# Altium schematic sheet RelayTester.SchDoc: Relay Tester
size A4 portrait; Date: 2018.12.12; DrawnBy: Ivan Perehiniak; Address2: Ivan Perehiniak; Address3: iv.perehinik@gmail.com; Revision: 3; SheetNumber: 1; SheetTotal: 6; ProjectName: Relay Tester
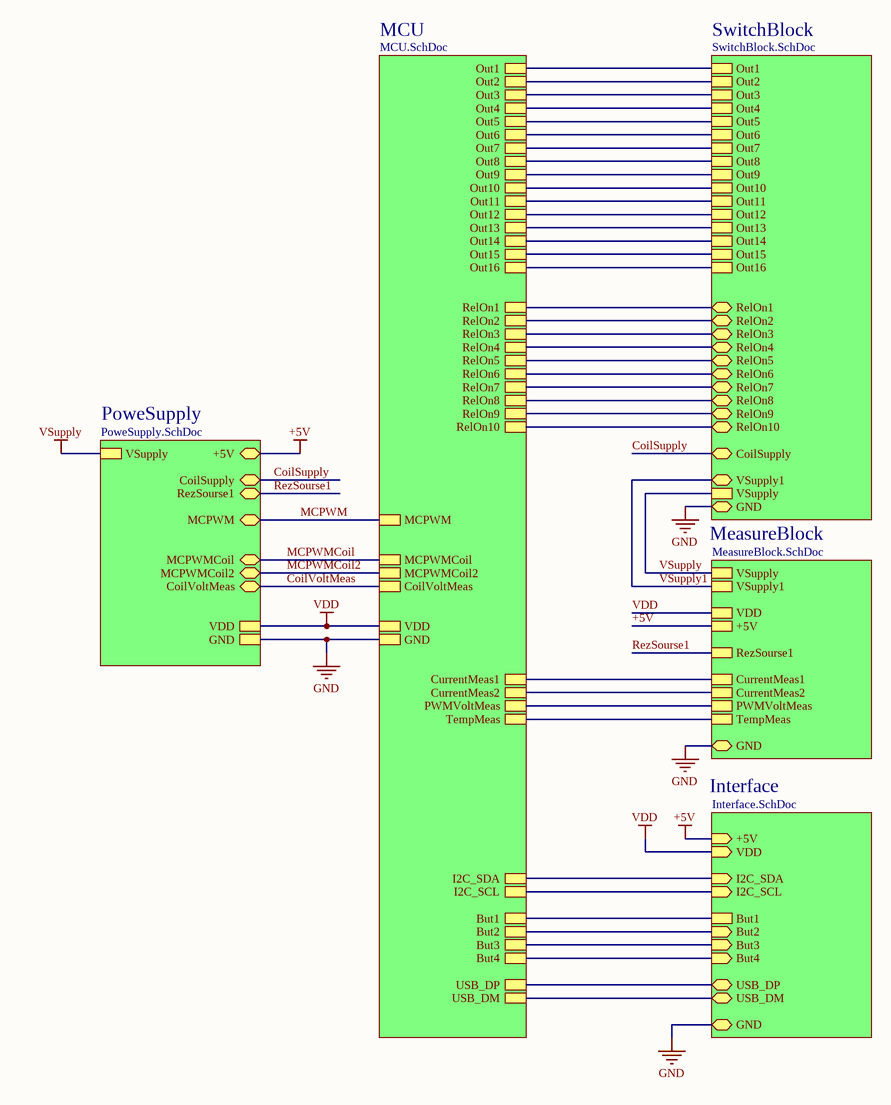
[diagram p0: RelayTester.SchDoc]

## Sub-sheets
Interface = Interface.SchDoc: +5V, I2C_SDA, I2C_SCL, GND, But1, But2, But3, But4, VDD, USB_DM, USB_DP
MCU = MCU.SchDoc: But1, But2, But3, But4, I2C_SCL, I2C_SDA, Out9, Out8, RelOn5, RelOn6, RelOn3, RelOn4, RelOn1, RelOn2, CoilVoltMeas, PWMVoltMeas, CurrentMeas1, CurrentMeas2, TempMeas, MCPWMCoil, MCPWM, RelOn9, RelOn10, MCPWMCoil2, USB_DM, USB_DP, Out13, Out15, Out14, Out16, RelOn7, RelOn8, Out1, Out3, Out2, Out4, Out6, Out5, Out7, Out10, Out12, Out11, VDD, GND
MeasureBlock = MeasureBlock.SchDoc: VSupply1, VSupply, VDD, CurrentMeas1, RezSourse1, PWMVoltMeas, CurrentMeas2, TempMeas, +5V, GND
PoweSupply = PoweSupply.SchDoc: VSupply, VDD, GND, +5V, CoilSupply, CoilVoltMeas, MCPWMCoil, MCPWMCoil2, MCPWM, RezSourse1
SwitchBlock = SwitchBlock.SchDoc: Out1, Out2, Out3, Out4, Out5, Out6, Out7, Out8, Out9, Out10, Out11, Out12, Out13, Out14, Out15, Out16, VSupply, GND, VSupply1, RelOn10, CoilSupply, RelOn9, RelOn8, RelOn4, RelOn7, RelOn2, RelOn3, RelOn1, RelOn5, RelOn6

## Nets
+5V: sheet Interface/+5V, sheet PoweSupply/+5V, sheet MeasureBlock/+5V
GND: sheet Interface/GND, sheet PoweSupply/GND, sheet MeasureBlock/GND, sheet MCU/GND, sheet SwitchBlock/GND
VDD: sheet Interface/VDD, sheet PoweSupply/VDD, sheet MeasureBlock/VDD, sheet MCU/VDD
VSupply: sheet PoweSupply/VSupply, sheet MeasureBlock/VSupply, sheet SwitchBlock/VSupply
CoilSupply: sheet PoweSupply/CoilSupply, sheet SwitchBlock/CoilSupply
CoilVoltMeas: sheet PoweSupply/CoilVoltMeas, sheet MCU/CoilVoltMeas
MCPWM: sheet PoweSupply/MCPWM, sheet MCU/MCPWM
MCPWMCoil: sheet PoweSupply/MCPWMCoil, sheet MCU/MCPWMCoil
MCPWMCoil2: sheet PoweSupply/MCPWMCoil2, sheet MCU/MCPWMCoil2
RezSourse1: sheet PoweSupply/RezSourse1, sheet MeasureBlock/RezSourse1
VSupply1: sheet MeasureBlock/VSupply1, sheet SwitchBlock/VSupply1
(unnamed): sheet Interface/I2C_SDA, sheet MCU/I2C_SDA
(unnamed): sheet Interface/I2C_SCL, sheet MCU/I2C_SCL
(unnamed): sheet Interface/But1, sheet MCU/But1
(unnamed): sheet Interface/But2, sheet MCU/But2
(unnamed): sheet Interface/But3, sheet MCU/But3
(unnamed): sheet Interface/But4, sheet MCU/But4
(unnamed): sheet Interface/USB_DM, sheet MCU/USB_DM
(unnamed): sheet Interface/USB_DP, sheet MCU/USB_DP
(unnamed): sheet MeasureBlock/CurrentMeas1, sheet MCU/CurrentMeas1
(unnamed): sheet MeasureBlock/PWMVoltMeas, sheet MCU/PWMVoltMeas
(unnamed): sheet MeasureBlock/CurrentMeas2, sheet MCU/CurrentMeas2
(unnamed): sheet MeasureBlock/TempMeas, sheet MCU/TempMeas
(unnamed): sheet MCU/Out9, sheet SwitchBlock/Out9
(unnamed): sheet MCU/Out8, sheet SwitchBlock/Out8
(unnamed): sheet MCU/RelOn5, sheet SwitchBlock/RelOn5
(unnamed): sheet MCU/RelOn6, sheet SwitchBlock/RelOn6
(unnamed): sheet MCU/RelOn3, sheet SwitchBlock/RelOn3
(unnamed): sheet MCU/RelOn4, sheet SwitchBlock/RelOn4
(unnamed): sheet MCU/RelOn1, sheet SwitchBlock/RelOn1
(unnamed): sheet MCU/RelOn2, sheet SwitchBlock/RelOn2
(unnamed): sheet MCU/RelOn9, sheet SwitchBlock/RelOn9
(unnamed): sheet MCU/RelOn10, sheet SwitchBlock/RelOn10
(unnamed): sheet MCU/Out13, sheet SwitchBlock/Out13
(unnamed): sheet MCU/Out15, sheet SwitchBlock/Out15
(unnamed): sheet MCU/Out14, sheet SwitchBlock/Out14
(unnamed): sheet MCU/Out16, sheet SwitchBlock/Out16
(unnamed): sheet MCU/RelOn7, sheet SwitchBlock/RelOn7
(unnamed): sheet MCU/RelOn8, sheet SwitchBlock/RelOn8
(unnamed): sheet MCU/Out1, sheet SwitchBlock/Out1
(unnamed): sheet MCU/Out3, sheet SwitchBlock/Out3
(unnamed): sheet MCU/Out2, sheet SwitchBlock/Out2
(unnamed): sheet MCU/Out4, sheet SwitchBlock/Out4
(unnamed): sheet MCU/Out6, sheet SwitchBlock/Out6
(unnamed): sheet MCU/Out5, sheet SwitchBlock/Out5
(unnamed): sheet MCU/Out7, sheet SwitchBlock/Out7
(unnamed): sheet MCU/Out10, sheet SwitchBlock/Out10
(unnamed): sheet MCU/Out12, sheet SwitchBlock/Out12
(unnamed): sheet MCU/Out11, sheet SwitchBlock/Out11

## Notes on the sheet
- Title
- Size:
- Date:
- A4
- Number:
- Time:
- Revision:
- Sheet
- of
- File: